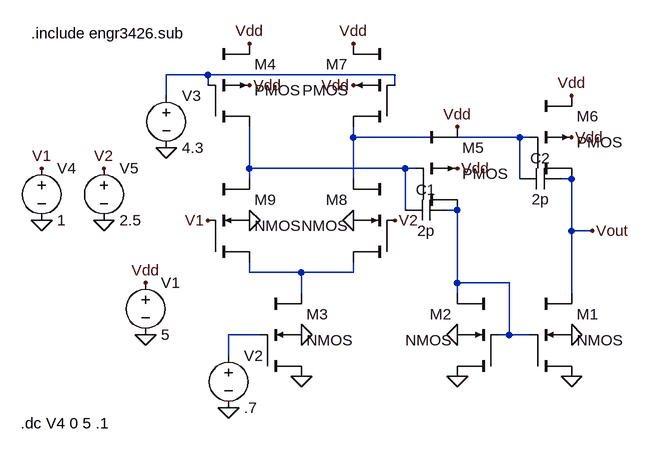
[diagram p0: schematic badamp.asc]
badamp.asc, the LTspice schematic file:
Version 4
SHEET 1 880 680
WIRE 96 -96 32 -96
WIRE 384 -96 96 -96
WIRE 96 -80 96 -96
WIRE 384 -80 384 -96
WIRE 32 -64 32 -96
WIRE 320 0 320 -16
WIRE 576 0 320 0
WIRE 592 0 576 0
WIRE 160 48 160 -16
WIRE 400 48 160 48
WIRE 416 48 400 48
WIRE 160 64 160 48
WIRE 320 64 320 0
WIRE 576 64 576 0
WIRE 656 64 640 64
WIRE 400 112 400 48
WIRE 480 112 464 112
WIRE 656 144 656 64
WIRE 688 144 656 144
WIRE 160 208 160 192
WIRE 240 208 160 208
WIRE 320 208 320 192
WIRE 320 208 240 208
WIRE 480 224 480 112
WIRE 560 224 480 224
WIRE 240 240 240 208
WIRE 480 240 480 224
WIRE 656 240 656 144
WIRE 176 304 128 304
WIRE 560 304 560 224
WIRE 560 304 544 304
WIRE 592 304 560 304
WIRE 128 336 128 304
FLAG 0 304 0
FLAG 0 224 Vdd
FLAG 160 -144 Vdd
FLAG 320 -144 Vdd
FLAG 656 -64 Vdd
FLAG 480 -16 Vdd
FLAG 320 128 0
FLAG 160 128 0
FLAG 240 304 0
FLAG 480 304 0
FLAG 656 304 0
FLAG 480 48 Vdd
FLAG 656 0 Vdd
FLAG 320 -80 Vdd
FLAG 160 -80 Vdd
FLAG 688 144 Vout
FLAG 96 128 V1
FLAG 384 128 V2
FLAG 240 368 0
FLAG 480 368 0
FLAG 656 368 0
FLAG 128 416 0
FLAG 32 16 0
FLAG -64 128 0
FLAG -160 128 0
FLAG -160 48 V1
FLAG -64 48 V2
SYMBOL cktsym\\nmos4 240 304 R0
SYMATTR InstName M3
SYMATTR Value2 l=1.8 w=72
SYMBOL cktsym\\pmos4 160 -80 R0
SYMATTR InstName M4
SYMATTR Value2 l=1.8 w=36
SYMBOL voltage 0 208 R0
WINDOW 123 0 0 Left 2
WINDOW 39 0 0 Left 2
SYMATTR InstName V1
SYMATTR Value 5
SYMBOL cap 464 96 R90
WINDOW 0 0 32 VBottom 2
WINDOW 3 32 32 VTop 2
SYMATTR InstName C1
SYMATTR Value 2p
SYMBOL cap 640 48 R90
WINDOW 0 0 32 VBottom 2
WINDOW 3 32 32 VTop 2
SYMATTR InstName C2
SYMATTR Value 2p
SYMBOL voltage 128 320 R0
WINDOW 123 0 0 Left 2
WINDOW 39 0 0 Left 2
SYMATTR InstName V2
SYMATTR Value .7
SYMBOL voltage 32 -80 R0
WINDOW 123 0 0 Left 2
WINDOW 39 0 0 Left 2
SYMATTR InstName V3
SYMATTR Value 4.3
SYMBOL voltage -160 32 R0
SYMATTR InstName V4
SYMATTR Value 1
SYMBOL voltage -64 32 R0
WINDOW 123 0 0 Left 2
WINDOW 39 0 0 Left 2
SYMATTR InstName V5
SYMATTR Value 2.5
SYMBOL cktsym\\pmos4 480 48 R0
SYMATTR InstName M5
SYMATTR Value2 l=1.8 w=36
SYMBOL cktsym\\pmos4 656 0 R0
SYMATTR InstName M6
SYMATTR Value2 l=1.8 w=36
SYMBOL cktsym\\pmos4 320 -80 M0
SYMATTR InstName M7
SYMATTR Value2 l=1.8 w=36
SYMBOL cktsym\\nmos4 656 304 R0
SYMATTR InstName M1
SYMATTR Value2 l=1.8 w=36
SYMBOL cktsym\\nmos4 480 304 M0
SYMATTR InstName M2
SYMATTR Value2 l=1.8 w=36
SYMBOL cktsym\\nmos4 320 128 M0
SYMATTR InstName M8
SYMATTR Value2 l=1.8 w=36
SYMBOL cktsym\\nmos4 160 128 R0
SYMATTR InstName M9
SYMATTR Value2 l=1.8 w=36
TEXT -192 440 Left 2 !.dc V4 0 5 .1
TEXT -176 -160 Left 2 !.include engr3426.sub

The netlist it stands for:
* badamp.asc
M3 N005 N006 0 0 NMOS l=1.8 w=72
M4 N003 N001 Vdd Vdd PMOS l=1.8 w=36
V1 Vdd 0 5
C1 N004 N003 2p
C2 Vout N002 2p
V2 N006 0 .7
V3 N001 0 4.3
V4 V1 0 1
V5 V2 0 2.5
M5 N004 N003 Vdd Vdd PMOS l=1.8 w=36
M6 Vout N002 Vdd Vdd PMOS l=1.8 w=36
M7 N002 N001 Vdd Vdd PMOS l=1.8 w=36
M1 Vout N004 0 0 NMOS l=1.8 w=36
M2 N004 N004 0 0 NMOS l=1.8 w=36
M8 N002 V2 N005 0 NMOS l=1.8 w=36
M9 N003 V1 N005 0 NMOS l=1.8 w=36
.model NMOS NMOS
.model PMOS PMOS
.lib standard.mos
.dc V4 0 5 .1
.include engr3426.sub
.backanno
.end